# Altium schematic sheet display.SchDoc
size 297 x 209 mm; Address1: Address1; Address2: Address2; Address3: Address3; Address4: Address4; SheetNumber: 1; Scale: 1:1; Обозначение документа: АБВГ.123456.001Э3
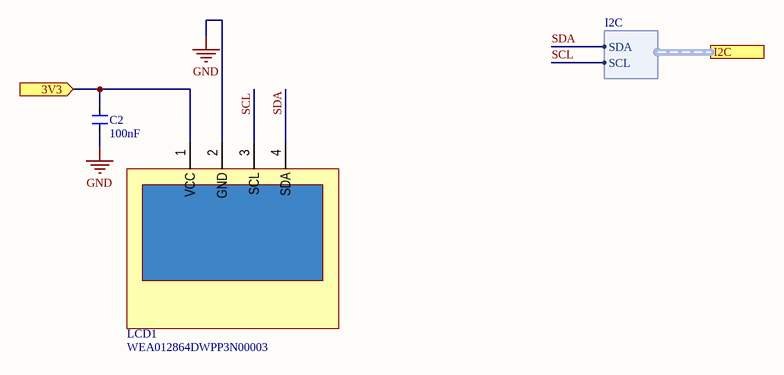
[diagram p0: display.SchDoc]

## Parts
C2  100nF  [CAP0603]
LCD1  WEA012864DWPP3N00003  [WEA012864DWPP3N00003]

## Ports
3V3 (in), I2C (harness I2C)

## Harnesses
I2C: SDA, SCL

## Nets
GND: C2.1 LCD1.2(GND)
3V3: C2.2 LCD1.1(VCC) ; port 3V3
SCL: LCD1.3(SCL) ; port I2C.SCL
SDA: LCD1.4(SDA) ; port I2C.SDA

## Notes on the sheet
- Подп. и дата
- Инв. № дубл.
- Взам. инв. №
- Инв. № подл.
- Изм.
- Лист
- № докум.
- Подп.
- Дата
- Копировал
- Формат А4

## Library data of the parts
C2 = GCM188R71H104KA57J: Tolerance ±10% / Rated Voltage 50Vdc / Temperature 0±30ppm/℃; Manufacturer: Arrow Electronics; Item: 100nF 50V  ±10%; Vdc: 50V; Part Number: GCM188R71H104KA57J; Supplier 1: Mouser; Supplier Part Number 1: 81-GCM188R71H104KA7J; Case: 0603; Tolerance: 10%; Value: 100nF; HelpURL: http://www.farnell.com/datasheets/4360.pdf?src-supplier=Element14; Category: Multilayer Ceramic Capacitors - SMD/SMT
LCD1 = WEA012864DWPP3N00003: OLED 0.96" display, 128x64, white,  IC SSD1306BZ, I2C, 3v, -40...+80°С; Manufacturer: Winstar; Part Number: WEA012864DWPP3N00003; Item: WEA012864DWPP3N00003; Supplier 1: ChipDip; Supplier Part Number 1: 8001808254; Case: none; HelpURL: https://www.compel.ru/item-pdf/bf9bb7bf1ce7223b4efcb84e5467b96d/pn/winstar~wea012864dwpp3n00003.pdf; Category: OLED displays